# EAGLE design nanoled + spliter (EAGLE 7.6.0)
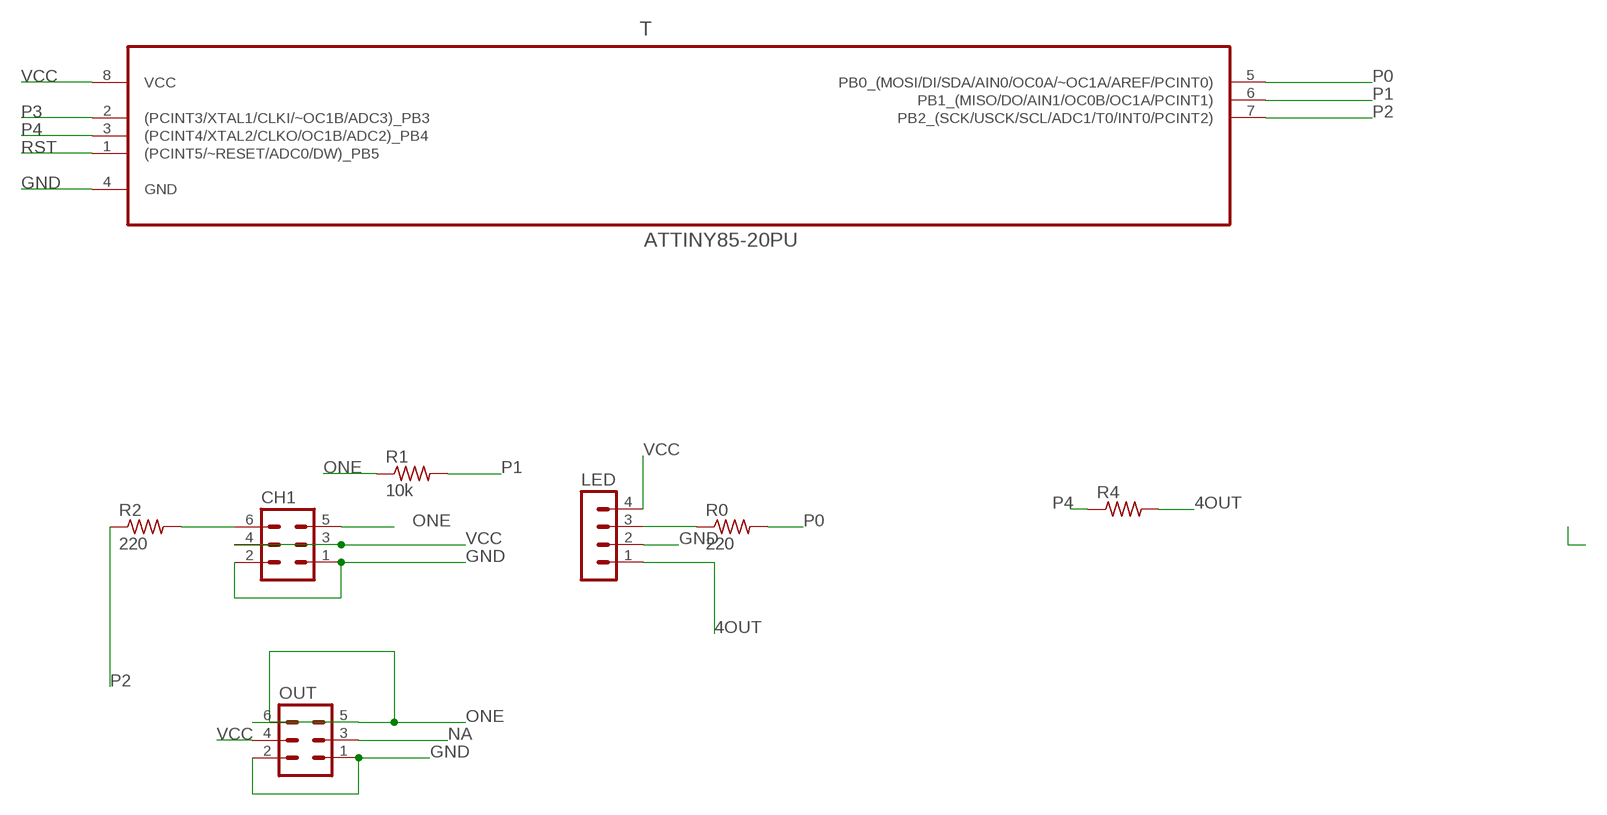
[diagram p0: schematic, sheet 1]

## Parts
CH1  MA03-2  [MA03-2]
LED  MA04-1  [MA04-1]
OUT  MA03-2  [MA03-2]
R0  220  R-US_0204/7  [0204/7]
R1  10k  R-US_0204/7  [0204/7]
R2  220  R-US_0204/7  [0204/7]
R4  R-US_0204/7  [0204/7]
T  ATTINY85-20PU  [DIP254P762X533-8]

## Nets
4OUT: LED.1 R4.2
GND: CH1.1 CH1.2 LED.2 OUT.1 OUT.2 T.4(GND)
N$1: LED.3 R0.1
N$4: CH1.6 R2.2
NA: OUT.3
ONE: CH1.5 OUT.5 OUT.6 R1.1
P0: R0.2 T.5(PB0_(MOSI/DI/SDA/AIN0/OC0A/~OC1A/AREF/PCINT0))
P1: R1.2 T.6(PB1_(MISO/DO/AIN1/OC0B/OC1A/PCINT1))
P2: R2.1 T.7(PB2_(SCK/USCK/SCL/ADC1/T0/INT0/PCINT2))
P3: T.2((PCINT3/XTAL1/CLKI/~OC1B/ADC3)_PB3)
P4: R4.1 T.3((PCINT4/XTAL2/CLKO/OC1B/ADC2)_PB4)
RST: T.1((PCINT5/~RESET/ADC0/DW)_PB5)
VCC: CH1.3 CH1.4 LED.4 OUT.4 T.8(VCC)

## Library data of the parts
CH1 OUT = con-lstb:MA03-2: PIN HEADER; OC_FARNELL: unknown; OC_NEWARK: unknown
LED = con-lstb:MA04-1: PIN HEADER; OC_FARNELL: unknown; OC_NEWARK: unknown
R0 R1 R2 R4 = resistor:R-US_: RESISTOR, American symbol
T = Atmel_By_element14_Batch_1-00:ATTINY85-20PU: 8-bit Microcontroller with In-System Programmable Flash; MPN: ATTINY85-20PU; OC_FARNELL: 1455162; OC_NEWARK: 58M3796; PACKAGE: PDIP-8; SUPPLIER: Atmel

## Board
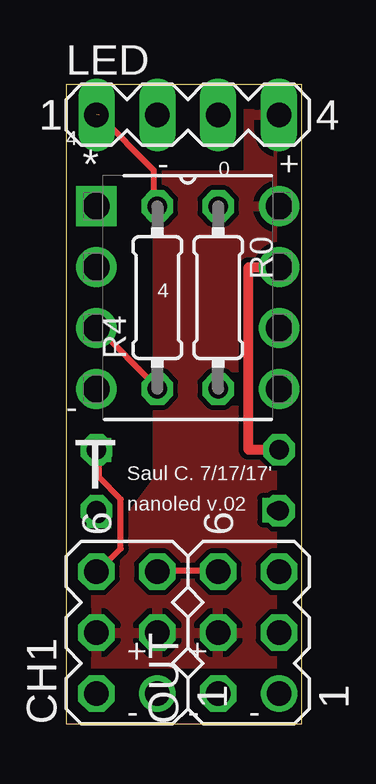
[diagram p1: board, top side]
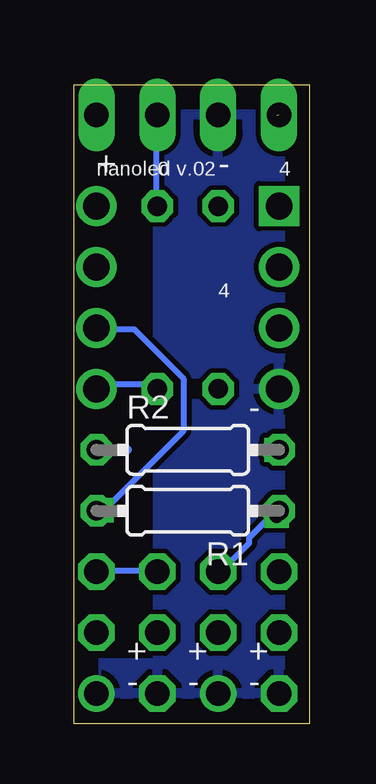
[diagram p2: board, bottom side, seen from below]

Size 9.83 x 26.66 mm. Coordinates in mm from the lower left corner, seen from the top.
Outline: 0,0 9.83,0 9.83,26.66 0,26.66 0,0
Copper layers (1*16): Top 0.035mm / dielectric 1.5mm / Bottom 0.035mm
Design rules "default": minimum track width 10mil, minimum drill 24mil, track to track 8mil, track to pad 8mil, pad to pad 8mil, via to via 8mil, smd to smd 8mil, copper to edge 40mil, drill to drill 8mil, minimum pad ring 10mil, minimum via ring 8mil, stop-mask expansion 4mil, vias tented up to drill 0mil, thermal gap 10mil

### Footprints (pad centres in the part's own frame; a part is rotated, then mirrored left to right if it is on the bottom)
MA03-2 = drill 1.016: 1 -2.54,-1.27 | drill 1.016 octagon: 2 -2.54,1.27; 3 0,-1.27; 4 0,1.27; 5 2.54,-1.27; 6 2.54,1.27
MA04-1 = drill 1.016 long: 1 -3.81,0; 2 -1.27,0; 3 1.27,0; 4 3.81,0
0204/7 = drill 0.813 octagon: 1 -3.81,0; 2 3.81,0
DIP254P762X533-8 = drill 1.118 square: 1 -7.62,7.62 | drill 1.118: 2 -7.62,5.08; 3 -7.62,2.54; 4 -7.62,0; 5 0,0; 6 0,2.54; 7 0,5.08; 8 0,7.62

### Placement (x,y rotation side)
CH1  2.54,3.81 90 top
LED  5.08,25.4 0 top
OUT  7.62,3.81 90 top
R0  6.35,17.78 270 top
R1  5.08,8.89 180 bottom
R2  5.08,11.43 0 bottom
R4  3.81,17.78 90 top
T  8.89,13.97 0 top

### Tracks (layer width: path | path; a pad name or v marks a point on that pad's centre or on a via)
4OUT  (1 unrouted)
  Top 0.254: 1.37,25.38 3.66,23.09 3.66,21.72 R4.2
GND
  pour Bottom: 0,0 0,26.67 6.35,26.67 6.35,2.54 10.16,2.54 10.16,0
N$1
  Bottom 0.254: R0.1 6.4,21.72 6.4,25.38 LED.3
N$4  (via drill 0.6)
  Top 0.254: v1.37,11.43 1.37,10.29 2.29,9.37 2.29,7.32 1.37,6.4 CH1.6
  Bottom 0.254: v1.37,11.43 R2.2
ONE  (via drill 0.6)
  Top 0.254: v1.37,8.69 R1.1 | OUT.6 6.17,6.4 3.89,6.4 CH1.5
  Bottom 0.254: OUT.6 6.4,6.4 8.69,6.4 OUT.5 | v1.37,8.69 1.6,8.69 2.52,7.77 2.52,7.54 3.66,6.4 CH1.5
P0
  Bottom 0.254: R0.2 6.4,14.17 8.69,14.17 T.5
P1  (via drill 0.6)
  Top 0.254: v8.69,8.91 R1.2
  Bottom 0.254: v8.69,8.91 8.69,8.79 5.26,12.22 5.26,14.4 7.32,16.46 8.69,16.46 T.6
P2
  Top 0.406: R2.1 7.62,11.43 7.62,19.05 T.7
  Bottom 0.406: 7.62,11.43 R2.1
P4
  Top 0.254: R4.1 3.66,14.17 1.37,16.46 T.3
VCC
  pour Top: 10.16,26.67 7.62,26.67 7.62,22.86 3.81,22.86 3.81,10.16 0,5.08 0,2.54 10.16,2.54

### Text on the board
tPlace: 4 | - | 0 | + | 4 | - | Saul C. 7/17/17' | nanoled v.02 | + | + | - | - | -
bPlace: 4 | - | 0 | + | nanoled v.02 | 4 | - | + | + | + | - | - | -